# Altium project Treinamento O Lendario.PrjPcb
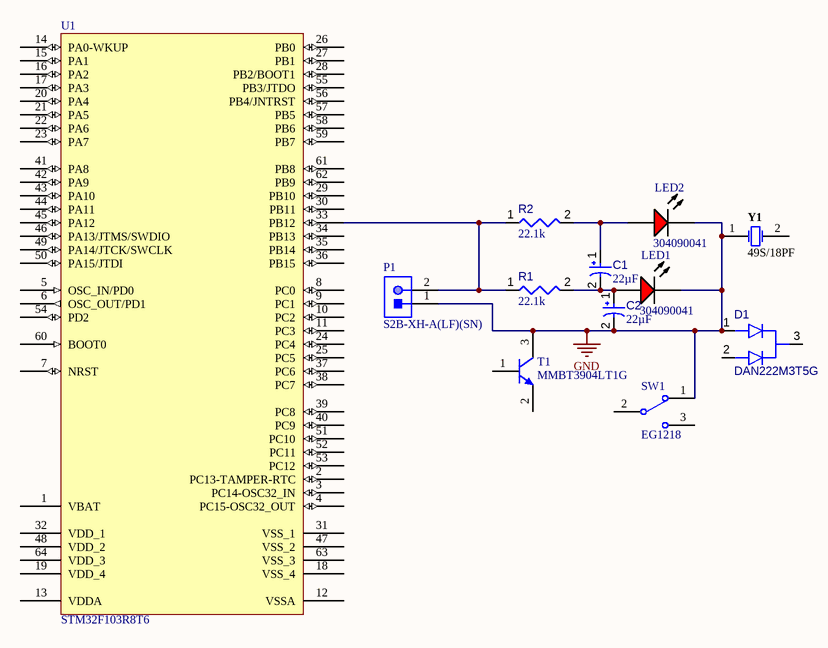
[diagram p0: Sheet1.SchDoc]
CAGE_CODE: ?????; CONTRACT_NUMBER: <CONTRACT NO>; DOC_NO_ASSY_DWG: <ASSY DWG NO>; DOC_NO_BOM: <BOM DOC NO>; DOC_NO_FAB_DWG: <FAB DWG NO>; DOC_NO_SCH_DWG: <SCH DWG NO>; PCB_2_DEC_TOL: +/-.01; PCB_3_DEC_TOL: +/-.010; PCB_ANG_TOL: +/-1/2; PCB_ASSEMBLY_NO: <PCB ASSY NO>; PCB_CHECKER: - -----; PCB_CHECKER_APP_DATE: --/--/----; PCB_DESIGNER: - -----; PCB_DESIGNER_APP_DATE: --/--/----; PCB_DWG_NO: <PCB DWG NO>; PCB_ENGINEER: - -----; PCB_ENGINEER_APP_DATE: --/--/----; PCB_PART_NUMBER: <PCB PN>; PCB_REV: A; SCH_REV: A
1 sheet, 12 parts. Net scope: global (net labels, ports and power ports of the same name join across sheets).
Board file: PCB1.PcbDoc

## Sheet Sheet1.SchDoc
size A4; SheetNumber: 1; SheetTotal: 1; ENG_APP_DATE: --/--/--; DSN_APP_DATE: --/--/--; CHK_APP_DATE: --/--/--

### Parts
C1  value 22µF  [CAPPR55-200-1100X500X1200]  (hidden comment: ECA1HM220)
C2  value 22µF  [CAPPR55-200-1100X500X1200]  (hidden comment: ECA1HM220)
D1  DAN222M3T5G  [ROHM-SOT723-3_V]
LED1  304090041  [LED-2P-2.28-3MM_A]
LED2  304090041  [LED-2P-2.28-3MM_A]
P1  S2B-XH-A(LF)(SN)  [JST-S2B-XH-A(LF)(SN)_V]
R1  value 22.1k  [RESA60-630X240]  (hidden comment: MFR-25FBF52-22K1)
R2  value 22.1k  [RESA60-630X240]  (hidden comment: MFR-25FBF52-22K1)
SW1  EG1218  [ESWI-EG1218_V]
T1  MMBT3904LT1G  [ONSC-SOT-23-3-318-08_V]
U1  STM32F103R8T6  [TSQFP50P1200X1200X160-64M]
Y1  49S/18PF  [JPY-49S-18PF]

### Nets
GND: C2.2 D1.1(A1) LED1.2(K) LED2.2(K) P1.1 SW1.1 T1.3(C) Y1.1
NetC1_1: C1.1 LED2.1(A) R2.2
NetC1_2: C1.2 C2.1 LED1.1(A) R1.2
NetP1_2: P1.2 R1.1 R2.1 U1.33(PB12)

Not connected (* = marked no-connect by the designer): D1 2(A2) 3(K); SW1 2(COM) 3; T1 1(B) 2(E); U1 1(VBAT) 2(PC13-TAMPER-RTC) 3(PC14-OSC32_IN) 4(PC15-OSC32_OUT) 5(OSC_IN/PD0) 6(OSC_OUT/PD1) 7(NRST) 8(PC0) 9(PC1) 10(PC2) 11(PC3) 12(VSSA) 13(VDDA) 14(PA0-WKUP) 15(PA1) 16(PA2) 17(PA3) 18(VSS_4) 19(VDD_4) 20(PA4) 21(PA5) 22(PA6) 23(PA7) 24(PC4) 25(PC5) 26(PB0) 27(PB1) 28(PB2/BOOT1) 29(PB10) 30(PB11) 31(VSS_1) 32(VDD_1) 34(PB13) 35(PB14) 36(PB15) 37(PC6) 38(PC7) 39(PC8) 40(PC9) 41(PA8) 42(PA9) 43(PA10) 44(PA11) 45(PA12) 46(PA13/JTMS/SWDIO) 47(VSS_2) 48(VDD_2) 49(PA14/JTCK/SWCLK) 50(PA15/JTDI) 51(PC10) 52(PC11) 53(PC12) 54(PD2) 55(PB3/JTDO) 56(PB4/JNTRST) 57(PB5) 58(PB6) 59(PB7) 60(BOOT0) 61(PB8) 62(PB9) 63(VSS_3) 64(VDD_3); Y1 2

### Notes on the sheet
- Title
- Size:
- Date:
- A4
- Number:
- Time:
- Revision:
- Sheet
- of
- File:

### Library data of the parts
C1 C2 = CMP-001-00027-7: Aluminum Electrolytic Capacitor, 22 uF, +/- 20%, 50 V, -40 to 85 degC, 2-Pin THD, RoHS, Bulk; Manufacturer: Panasonic; Ripple Current (AC): 100mA; Voltage Rating: 50V; Pins: 2; Case/Package: Radial; Datasheet Version: Rev. 05, 10/2016; RoHS Compliant: True; Max Operating Temperature: 85°C; Ripple Current: 100mA; Capacitor Type: Electrolytic; Mounting Technology: TH; Package Quantity: 200; Package Reference: CAPPR55-200-1100X500X1200; Package Description: 2-Pin Radial Lead, Dia 5 mm, Height 12 mm; Packaging: Bulk; Lead Pitch: 2mm; Min Operating Temperature: -40°C; Diameter: 5mm; Tolerance: 20%; Datasheet URL: https://industrial.panasonic.com/cdbs/www-data/pdf/RDF0000/ABA0000C1218.pdf; Manufacturer URL: http://www.panasonic.com/
D1 = CMP-004-00027-3: Common Cathode Silicon Dual Switching Diodes, 3-Pin SOT-723, Pb-Free, Tape and Reel; Forward Current: 100mA; ComponentLink2URL: http://www.onsemi.cn/pub_link/Collateral/DAN222M3-D.PDF; ComponentLink3Description: Package Specification; Pins: 3; ComponentLink2Description: Datasheet; ComponentLink3URL: http://www.onsemi.com/pub_link/Collateral/631AA.PDF; ComponentLink1URL: http://www.onsemi.com/; Mounting Technology: SMT; ComponentLink1Description: Manufacturer URL
LED1 LED2 = CMP-007-00007-2: Red LED, 80 mW, 30 mA, -25 to 85 degC, 2-Pin THD; Manufacturer: Shenzhen CGX; Package Description: 2-Pin Through Hole Device, Dia 3 mm, Pitch 2.28 mm; Datasheet URL: http://datasheet.octopart.com/304090041-Chengguangxing-datasheet-62330656.pdf; Mounting Technology: TH; Manufacturer URL: http://szcgx.com/; RoHS Compliant: Unknown; Datasheet Version: Sep-14; Case/Package: 304090041; Package Reference: 304090041
P1 = CMP-002-00032-2: Male Header, Pitch 2.5 mm, 1 x 2 Position, Height 6.1 mm, Tail Length 3.4 mm, -25 to 85 degC, RoHS, Bulk; Manufacturer: JST; Case/Package: S2B-XH-A(LF)(SN); Package Description: XH Series Disconnectable Crimp Style Connector, Pitch 2.5 mm, 1 x 2 Position, Height 6.1 mm, Tail Length 3.4 mm; Manufacturer URL: http://www.jst.com/home2.html; Datasheet URL: http://www.jst-mfg.com/product/pdf/eng/eXH.pdf; Connector Type: Header; Package Reference: S2B-XH-A(LF)(SN); Mounting Technology: TH; Max Operating Temperature: 85°C; Min Operating Temperature: -25°C; Datasheet Version: May-16; Gender: Male; RoHS Compliant: Unknown
R1 R2 = CMP-009-00052-4: Axial Resistor, 22.1 KOhm, +/- 1%, 0.25 W, -55 to 155 degC, 2-Pin THD, RoHS, Bulk; Manufacturer: Yageo; Power: 250mW; Voltage Rating: 250V; Packaging: Bulk; Max Operating Temperature: 155°C; Case/Package: Axial; Tolerance: 1%; Mounting Technology: TH; Min Operating Temperature: -55°C; RoHS Compliant: True; Package Quantity: 200; Package Reference: MFR-25; Manufacturer URL: http://www.yageo.com/; Package Description: 2-Pin Axial Lead, Dia 2.4 mm, Body Length 6.3 mm; Datasheet Version: Apr-13; Datasheet URL: http://www.yageo.com/documents/recent/Yageo%20LR_MFR_2013.pdf
SW1 = CMP-011-00006-2: Slide Switch, SPDT, 500 V, -20 to 70 degC, 3-Pin THD, RoHS, Bulk; Manufacturer: E-Switch; Voltage Rating (DC): 30V; Current Rating: 200mA; Operating Force: 250gf; Package Quantity: 1000; Contact Plating: Silver; Max Operating Temperature: 70°C; Min Operating Temperature: -20°C; Contact Material: Copper; Datasheet URL: https://www.e-switch.com/system/asset/product_line/data_sheet/119/EG.pdf; Contact Finish: Silver; Case/Package: EG1218; Voltage Rating (AC): 30V; Datasheet Version: Oct-15; Package Description: 3-Pin Through Hole Device, Body 11.6 x 4 mm, Pitch 2.5 mm; RoHS Compliant: True; Package Reference: EG1218; Manufacturer URL: http://www.e-switch.ch/en/; Throw Configuration: SPDT; Contact Current Rating: 200mA; Mounting Technology: TH; Packaging: Bulk; Pins: 3
T1 = CMP-013-00007-3: General Purpose Transistor, NPN Silicon, 40 V, 0.2 A, -55 to 150 degC, 3-Pin SOT23, RoHS, Tape and Reel; Manufacturer: ON Semiconductor; Elements: 1; Power: 225mW; Frequency: 300MHz; hFE Min: 80; Vce Max: 300mV; Mounting Technology: SM; Min Operating Temperature: -55°C; Datasheet URL: http://www.onsemi.cn/pub_link/Collateral/MMBT3904LT1-D.PDF; Pins: 3; Package Description: 3-Pin Small Outline Transistor, Body 2.9 x 1.3 mm, Pitch 0.95 mm; Max Operating Temperature: 150°C; Package Reference: SOT-23 (318-08); Package Quantity: 3000; RoHS Compliant: True; Packaging: TapeandReel; Datasheet Version: Rev. 12, 11/2012; Case/Package: TO-236-3
U1 = STM32F103R8T6: STM32 ARM-based 32-bit MCU with 64 Kbytes Flash, 64-pin LQFP, Industrial Temperature; Published: 30-May-2008; DatasheetVersion: rev6, Mar-2008; PackageVersion: Mar-2008; PackageReference: LQFP64; Publisher: Altium Limited; PackageDescription: 64-Pin Low-Profile Quad Flat Pack, 10 x 10 mm Body, 0.5 mm Pitch (LQFP64); ComponentLink1Description: Manufacturer Link; ComponentLink1URL: www.st.com/stm32; ComponentLink2Description: Datasheet; ComponentLink2URL: http://www.st.com/stonline/products/literature/ds/13587.pdf
Y1 = CMP-003-00000-2: Crystal, 16 MHz, +/-20 ppm, 18 pF, -20 to 70 degC, 2-Pin THD, RoHS; Manufacturer: Shenzhen Jingpengyuan; Frequency: 16MHz; Package Description: 2-Pin Through Hole Device, Body 11.05 x 4.65 mm, Pitch 4.88 mm; Mounting Technology: TH; Datasheet Version: Aug-14; Package Reference: 49S-18PF; RoHS Compliant: Unknown; Datasheet URL: http://datasheet.octopart.com/49S-18PF-Xinhunjing-datasheet-30677139.pdf; Case/Package: 49S-18PF; Manufacturer URL: http://www.chjiahui.com/